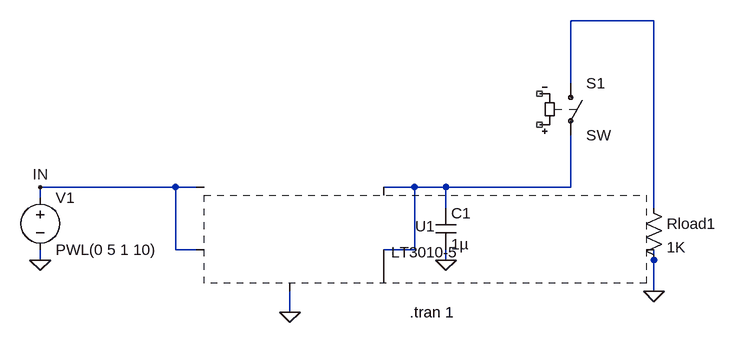
[diagram p0: schematic 3010-5.asc]
3010-5.asc, the LTspice schematic file:
Version 4
SHEET 1 880 680
WIRE 736 -208 608 -208
WIRE 608 -112 608 -208
WIRE 0 48 -208 48
WIRE 32 48 0 48
WIRE 368 48 320 48
WIRE 416 48 368 48
WIRE 608 48 608 -32
WIRE 608 48 416 48
WIRE -208 64 -208 48
WIRE 416 80 416 48
WIRE 736 80 736 -208
WIRE 0 144 0 48
WIRE 32 144 0 144
WIRE 368 144 368 48
WIRE 368 144 320 144
WIRE -208 160 -208 144
WIRE 416 160 416 144
WIRE 736 160 736 144
WIRE 736 208 736 160
WIRE 176 240 176 208
FLAG -208 160 0
FLAG 416 160 0
FLAG 176 240 0
FLAG -208 48 IN
FLAG 736 208 0
SYMBOL voltage -208 48 R0
WINDOW 123 0 0 Left 0
WINDOW 39 0 0 Left 0
SYMATTR InstName V1
SYMATTR Value PWL(0 5 1 10)
SYMBOL cap 400 80 R0
SYMATTR InstName C1
SYMATTR Value 1µ
SYMBOL PowerProducts\\LT3010-5 176 96 R0
SYMATTR InstName U1
SYMBOL sw 608 -128 R0
SYMATTR InstName S1
SYMATTR SpiceModel 5
SYMATTR Value2 10
SYMBOL res 720 64 R0
SYMATTR InstName Rload1
SYMATTR Value 1K
TEXT 360 240 Left 2 !.tran 1

The netlist it stands for:
* 3010-5.asc
V1 IN 0 PWL(0 5 1 10)
C1 N002 0 1µ
* U1: LT3010-5 (symbol PowerProducts\LT3010-5 not available, pin order unknown); nets seen at it: 0, IN, N002
S1 N001 N002 NC_01 NC_02 5 SW 10
Rload1 N001 0 1K
.tran 1
.backanno
.end